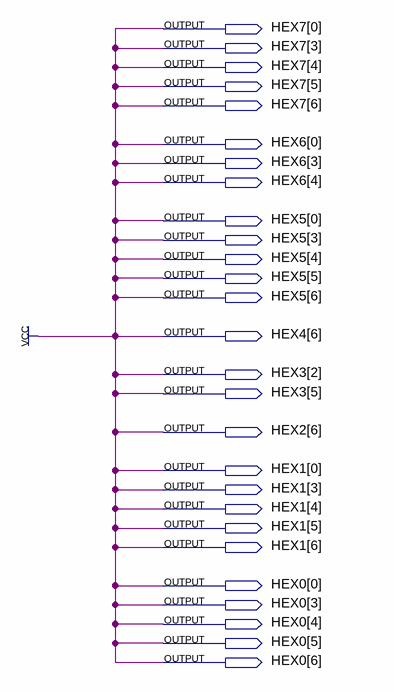
[diagram p0: schematic sheet]
// Quartus schematic datum.bdf as structural Verilog: 0 symbols, 27 pins
module datum (
  output [6:0] HEX7,
  output [4:0] HEX6,
  output [6:0] HEX5,
  output [6:6] HEX4,
  output [5:2] HEX3,
  output [6:6] HEX2,
  output [6:0] HEX1,
  output [6:0] HEX0
);


  assign {HEX0[6:3], HEX0[0]} = {5{1'b1}};
  assign {HEX1[6:3], HEX1[0]} = {5{1'b1}};
  assign HEX2[6] = 1'b1;
  assign {HEX3[5], HEX3[2]} = 2'b11;
  assign HEX4[6] = 1'b1;
  assign {HEX5[6:3], HEX5[0]} = {5{1'b1}};
  assign {HEX6[4:3], HEX6[0]} = 3'b111;
  assign {HEX7[6:3], HEX7[0]} = {5{1'b1}};
endmodule
